# Altium schematic sheet MCU.SchDoc
size A3; SheetNumber: 7; SheetTotal: 13
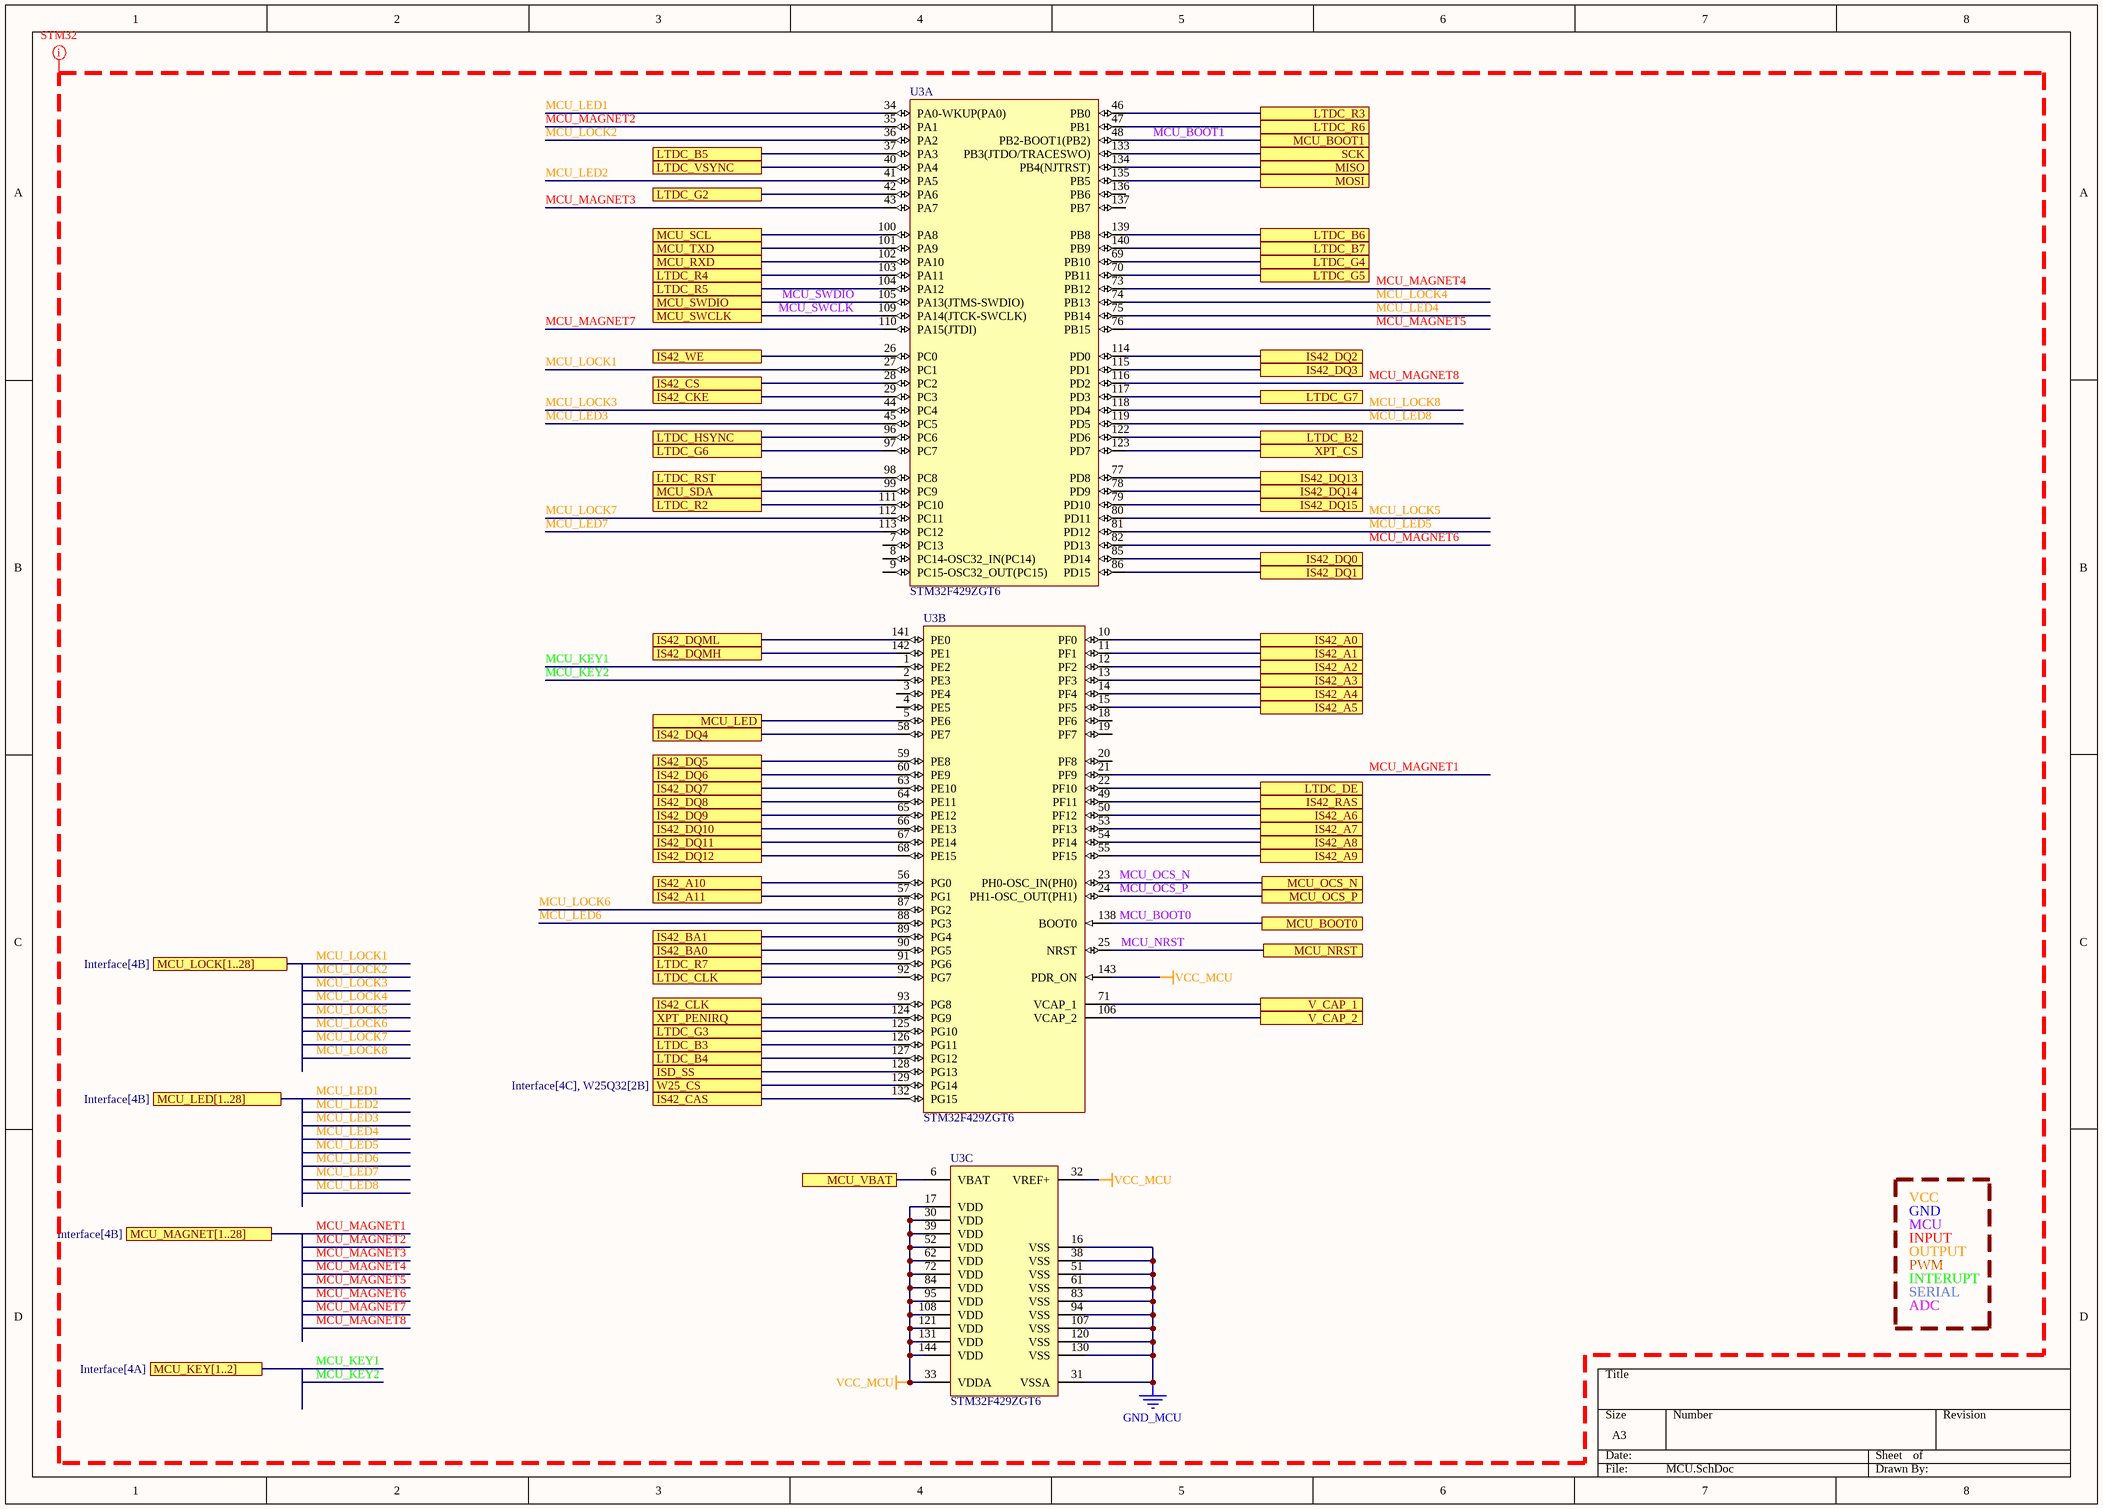
[diagram p0: MCU.SchDoc]

## Parts
U3  STM32F429ZGT6  [STM-LQFP144_N]  (parts A,B,C of 3)

## Ports
IS42_A0 (see Interface[4C], IS42S16400J[3B]), IS42_A1 (see Interface[4C], IS42S16400J[3B]), IS42_A2 (see Interface[4D], IS42S16400J[3B]), IS42_A3 (see Interface[4D], IS42S16400J[3B]), IS42_A4 (see Interface[4D], IS42S16400J[3B]), IS42_A5 (see Interface[4D], IS42S16400J[3B]), IS42_A6 (see Interface[4D], IS42S16400J[3B]), IS42_A7 (see Interface[4D], IS42S16400J[3B]), IS42_A8 (see Interface[4D], IS42S16400J[3B]), IS42_A9 (see Interface[4D], IS42S16400J[3C]), IS42_A10 (see Interface[4D], IS42S16400J[3C]), IS42_A11 (see Interface[4D], IS42S16400J[3C]), IS42_BA0 (see Interface[4C], IS42S16400J[1B]), IS42_BA1 (see Interface[4C], IS42S16400J[1B]), IS42_CAS (see Interface[4D], IS42S16400J[3C]), IS42_CKE (see Interface[4D], IS42S16400J[3C]), IS42_CLK (see Interface[4D], IS42S16400J[3C]), IS42_CS (see Interface[4D], IS42S16400J[3C]), IS42_DQ0 (see Interface[4C], IS42S16400J[1B]), IS42_DQ1 (see Interface[4C], IS42S16400J[1B]), IS42_DQ2 (see Interface[4C], IS42S16400J[1B]), IS42_DQ3 (see Interface[4C], IS42S16400J[1B]), IS42_DQ4 (see Interface[4C], IS42S16400J[1B]), IS42_DQ5 (see Interface[4C], IS42S16400J[1B]), IS42_DQ6 (see Interface[4C], IS42S16400J[1C]), IS42_DQ7 (see Interface[4C], IS42S16400J[1C]), IS42_DQ8 (see Interface[4C], IS42S16400J[1C]), IS42_DQ9 (see Interface[4C], IS42S16400J[1C]), IS42_DQ10 (see Interface[4C], IS42S16400J[1C]), IS42_DQ11 (see Interface[4C], IS42S16400J[1C]), IS42_DQ12 (see Interface[4C], IS42S16400J[1C]), IS42_DQ13 (see Interface[4C], IS42S16400J[1C]), IS42_DQ14 (see Interface[4C], IS42S16400J[1C]), IS42_DQ15 (see Interface[4C], IS42S16400J[1C]), IS42_DQMH (see Interface[4D], IS42S16400J[3C]), IS42_DQML (see Interface[4D], IS42S16400J[3C]), IS42_RAS (see Interface[4D], IS42S16400J[3C]), IS42_WE (see Interface[4D], IS42S16400J[3C]), ISD_SS (see Interface[4B], ISD1730[1B]), LTDC_B2 (see Interface[6C], LCD TFT 50 Pin[3B]), LTDC_B3 (see Interface[6C], LCD TFT 50 Pin[3B]), LTDC_B4 (see Interface[6C], LCD TFT 50 Pin[3B]), LTDC_B5 (see Interface[6C], LCD TFT 50 Pin[3A]), LTDC_B6 (see Interface[6B], LCD TFT 50 Pin[3A]), LTDC_B7 (see Interface[6B], LCD TFT 50 Pin[3A]), LTDC_CLK (see Interface[6C], LCD TFT 50 Pin[3C]), LTDC_DE (see Interface[6C], LCD TFT 50 Pin[3C]), LTDC_G2 (see Interface[6C], LCD TFT 50 Pin[3B]), LTDC_G3 (see Interface[6C], LCD TFT 50 Pin[3B]), LTDC_G4 (see Interface[6C], LCD TFT 50 Pin[3B]), LTDC_G5 (see Interface[6C], LCD TFT 50 Pin[3B]), LTDC_G6 (see Interface[6C], LCD TFT 50 Pin[3B]), LTDC_G7 (see Interface[6C], LCD TFT 50 Pin[3B]), LTDC_HSYNC (see Interface[6D], LCD TFT 50 Pin[3C]), LTDC_R2 (see Interface[6C], LCD TFT 50 Pin[3C]), LTDC_R3 (see Interface[6C], LCD TFT 50 Pin[3C]), LTDC_R4 (see Interface[6C], LCD TFT 50 Pin[3B]), LTDC_R5 (see Interface[6C], LCD TFT 50 Pin[3B]), LTDC_R6 (see Interface[6C], LCD TFT 50 Pin[3B]), LTDC_R7 (see Interface[6C], LCD TFT 50 Pin[3B]), LTDC_RST (see Interface[6D], LCD TFT 50 Pin[3C]), LTDC_VSYNC (see Interface[6C], LCD TFT 50 Pin[3C]), MCU_BOOT0 (see Interface[6A], STM32_AUX[2B]), MCU_BOOT1 (see Interface[6A], STM32_AUX[2A]), MCU_KEY[1..2] (see Interface[4A]), MCU_LED (see Interface[4A]), MCU_LED[1..28] (see Interface[4B]), MCU_LOCK[1..28] (see Interface[4B]), MCU_MAGNET[1..28] (see Interface[4B]), MCU_NRST (see Interface[6B], STM32_AUX[3A]), MCU_OCS_N (see Interface[6B], STM32_AUX[4A]), MCU_OCS_P (see Interface[6B], STM32_AUX[4A]), MCU_RXD (see Interface[6A]), MCU_SCL (see Interface[4A], EEPROM[3B]), MCU_SDA (see Interface[4A], EEPROM[3B]), MCU_SWCLK (see Interface[6A], STM32_AUX[2B]), MCU_SWDIO (see Interface[6A], STM32_AUX[2B]), MCU_TXD (see Interface[6A]), MCU_VBAT (see Interface[6B], STM32_AUX[1D]), MISO (see Interface[4B]), MOSI (see Interface[4B]), SCK (see Interface[4B]), V_CAP_1 (see Interface[6B], STM32_AUX[3C]), V_CAP_2 (see Interface[6B], STM32_AUX[3C]), W25_CS (see Interface[4C], W25Q32[2B]), XPT_CS (see Interface[4B], Touch XPT2046[3C]), XPT_PENIRQ (see Interface[4B], Touch XPT2046[3C])

## Nets
GND_MCU: U3.16(VSS) U3.31(VSSA) U3.38(VSS) U3.51(VSS) U3.61(VSS) U3.83(VSS) U3.94(VSS) U3.107(VSS) U3.120(VSS) U3.130(VSS)
VCC_MCU: U3.17(VDD) U3.30(VDD) U3.32(VREF+) U3.33(VDDA) U3.39(VDD) U3.52(VDD) U3.62(VDD) U3.72(VDD) U3.84(VDD) U3.95(VDD) U3.108(VDD) U3.121(VDD) U3.131(VDD) U3.143(PDR_ON) U3.144(VDD)
IS42_A0: U3.10(PF0) ; port IS42_A0
IS42_A1: U3.11(PF1) ; port IS42_A1
IS42_A2: U3.12(PF2) ; port IS42_A2
IS42_A3: U3.13(PF3) ; port IS42_A3
IS42_A4: U3.14(PF4) ; port IS42_A4
IS42_A5: U3.15(PF5) ; port IS42_A5
IS42_A6: U3.50(PF12) ; port IS42_A6
IS42_A7: U3.53(PF13) ; port IS42_A7
IS42_A8: U3.54(PF14) ; port IS42_A8
IS42_A9: U3.55(PF15) ; port IS42_A9
IS42_A10: U3.56(PG0) ; port IS42_A10
IS42_A11: U3.57(PG1) ; port IS42_A11
IS42_BA0: U3.90(PG5) ; port IS42_BA0
IS42_BA1: U3.89(PG4) ; port IS42_BA1
IS42_CAS: U3.132(PG15) ; port IS42_CAS
IS42_CKE: U3.29(PC3) ; port IS42_CKE
IS42_CLK: U3.93(PG8) ; port IS42_CLK
IS42_CS: U3.28(PC2) ; port IS42_CS
IS42_DQ0: U3.85(PD14) ; port IS42_DQ0
IS42_DQ1: U3.86(PD15) ; port IS42_DQ1
IS42_DQ2: U3.114(PD0) ; port IS42_DQ2
IS42_DQ3: U3.115(PD1) ; port IS42_DQ3
IS42_DQ4: U3.58(PE7) ; port IS42_DQ4
IS42_DQ5: U3.59(PE8) ; port IS42_DQ5
IS42_DQ6: U3.60(PE9) ; port IS42_DQ6
IS42_DQ7: U3.63(PE10) ; port IS42_DQ7
IS42_DQ8: U3.64(PE11) ; port IS42_DQ8
IS42_DQ9: U3.65(PE12) ; port IS42_DQ9
IS42_DQ10: U3.66(PE13) ; port IS42_DQ10
IS42_DQ11: U3.67(PE14) ; port IS42_DQ11
IS42_DQ12: U3.68(PE15) ; port IS42_DQ12
IS42_DQ13: U3.77(PD8) ; port IS42_DQ13
IS42_DQ14: U3.78(PD9) ; port IS42_DQ14
IS42_DQ15: U3.79(PD10) ; port IS42_DQ15
IS42_DQMH: U3.142(PE1) ; port IS42_DQMH
IS42_DQML: U3.141(PE0) ; port IS42_DQML
IS42_RAS: U3.49(PF11) ; port IS42_RAS
IS42_WE: U3.26(PC0) ; port IS42_WE
ISD_SS: U3.128(PG13) ; port ISD_SS
LTDC_B2: U3.122(PD6) ; port LTDC_B2
LTDC_B3: U3.126(PG11) ; port LTDC_B3
LTDC_B4: U3.127(PG12) ; port LTDC_B4
LTDC_B5: U3.37(PA3) ; port LTDC_B5
LTDC_B6: U3.139(PB8) ; port LTDC_B6
LTDC_B7: U3.140(PB9) ; port LTDC_B7
LTDC_CLK: U3.92(PG7) ; port LTDC_CLK
LTDC_DE: U3.22(PF10) ; port LTDC_DE
LTDC_G2: U3.42(PA6) ; port LTDC_G2
LTDC_G3: U3.125(PG10) ; port LTDC_G3
LTDC_G4: U3.69(PB10) ; port LTDC_G4
LTDC_G5: U3.70(PB11) ; port LTDC_G5
LTDC_G6: U3.97(PC7) ; port LTDC_G6
LTDC_G7: U3.117(PD3) ; port LTDC_G7
LTDC_HSYNC: U3.96(PC6) ; port LTDC_HSYNC
LTDC_R2: U3.111(PC10) ; port LTDC_R2
LTDC_R3: U3.46(PB0) ; port LTDC_R3
LTDC_R4: U3.103(PA11) ; port LTDC_R4
LTDC_R5: U3.104(PA12) ; port LTDC_R5
LTDC_R6: U3.47(PB1) ; port LTDC_R6
LTDC_R7: U3.91(PG6) ; port LTDC_R7
LTDC_RST: U3.98(PC8) ; port LTDC_RST
LTDC_VSYNC: U3.40(PA4) ; port LTDC_VSYNC
MCU_BOOT0: U3.138(BOOT0) ; port MCU_BOOT0
MCU_BOOT1: U3.48(PB2-BOOT1(PB2)) ; port MCU_BOOT1
MCU_KEY1: U3.1(PE2)
MCU_KEY2: U3.2(PE3)
MCU_LED: U3.5(PE6) ; port MCU_LED
MCU_LED1: U3.34(PA0-WKUP(PA0))
MCU_LED2: U3.41(PA5)
MCU_LED3: U3.45(PC5)
MCU_LED4: U3.75(PB14)
MCU_LED5: U3.81(PD12)
MCU_LED6: U3.88(PG3)
MCU_LED7: U3.113(PC12)
MCU_LED8: U3.119(PD5)
MCU_LOCK1: U3.27(PC1)
MCU_LOCK2: U3.36(PA2)
MCU_LOCK3: U3.44(PC4)
MCU_LOCK4: U3.74(PB13)
MCU_LOCK5: U3.80(PD11)
MCU_LOCK6: U3.87(PG2)
MCU_LOCK7: U3.112(PC11)
MCU_LOCK8: U3.118(PD4)
MCU_MAGNET1: U3.21(PF9)
MCU_MAGNET2: U3.35(PA1)
MCU_MAGNET3: U3.43(PA7)
MCU_MAGNET4: U3.73(PB12)
MCU_MAGNET5: U3.76(PB15)
MCU_MAGNET6: U3.82(PD13)
MCU_MAGNET7: U3.110(PA15(JTDI))
MCU_MAGNET8: U3.116(PD2)
MCU_NRST: U3.25(NRST) ; port MCU_NRST
MCU_OCS_N: U3.23(PH0-OSC_IN(PH0)) ; port MCU_OCS_N
MCU_OCS_P: U3.24(PH1-OSC_OUT(PH1)) ; port MCU_OCS_P
MCU_RXD: U3.102(PA10) ; port MCU_RXD
MCU_SCL: U3.100(PA8) ; port MCU_SCL
MCU_SDA: U3.99(PC9) ; port MCU_SDA
MCU_SWCLK: U3.109(PA14(JTCK-SWCLK)) ; port MCU_SWCLK
MCU_SWDIO: U3.105(PA13(JTMS-SWDIO)) ; port MCU_SWDIO
MCU_TXD: U3.101(PA9) ; port MCU_TXD
MCU_VBAT: U3.6(VBAT) ; port MCU_VBAT
MISO: U3.134(PB4(NJTRST)) ; port MISO
MOSI: U3.135(PB5) ; port MOSI
SCK: U3.133(PB3(JTDO/TRACESWO)) ; port SCK
V_CAP_1: U3.71(VCAP_1) ; port V_CAP_1
V_CAP_2: U3.106(VCAP_2) ; port V_CAP_2
W25_CS: U3.129(PG14) ; port W25_CS
XPT_CS: U3.123(PD7) ; port XPT_CS
XPT_PENIRQ: U3.124(PG9) ; port XPT_PENIRQ

Not connected (* = marked no-connect by the designer): U3 3(PE4) 4(PE5) 7(PC13) 8(PC14-OSC32_IN(PC14)) 9(PC15-OSC32_OUT(PC15)) 18(PF6) 19(PF7) 20(PF8) 136(PB6) 137(PB7)

## Layout directives
net class STM32: GND_MCU, MCU_BOOT0, MCU_BOOT1, MCU_KEY1, MCU_KEY2, MCU_LED1, MCU_LED2, MCU_LED3, MCU_LED4, MCU_LED5, MCU_LED6, MCU_LED7, MCU_LED8, MCU_LOCK1, MCU_LOCK2, MCU_LOCK3, MCU_LOCK4, MCU_LOCK5, MCU_LOCK6, MCU_LOCK7, MCU_LOCK8, MCU_MAGNET1, MCU_MAGNET2, MCU_MAGNET3, MCU_MAGNET4, MCU_MAGNET5, MCU_MAGNET6, MCU_MAGNET7, MCU_MAGNET8, MCU_NRST, MCU_OCS_N, MCU_OCS_P, MCU_SWCLK, MCU_SWDIO, VCC_MCU

## Notes on the sheet
- INPUT
- OUTPUT
- MCU
- GND
- VCC
- INTERUPT
- SERIAL
- ADC
- PWM

## Library data of the parts
U3 = STM32F429ZGT6: ARM Cortex-M4 32-bit MCU+FPU, 225 DMIPS, 1024 kB Flash, 256 kB Internal RAM, 114 I/Os, 144-pin LQFP, -40 to 85 degC, Tray; Manufacturer: STMicroelectronics; D/A Converter: 2x12-bit; FLASH Size (Prog) (kB): 1024; I/Os (High Current): 114; Internal RAM Size (kB): 256; Operating Frequency(F) (Processor speed) (MHz): 180; Supply Voltage(Vcc) max (V): 3.6; Supply Voltage(Vcc) min (V): 1.8; DatasheetVersion: Rev. 2; PackageVersion: Rev. 4, 06/2013; PackageReference: LQFP144; PackageDescription: 144-Pin Low Profile Quad Flat Package, 20 x 20 mm Body, 0.5 mm Pitch; Supplier 1: Digi-Key; Supplier Part Number 1: STM32F429ZGT6-ND; Supplier 2: Newark; Supplier Part Number 2: 06X3675; Supplier 3: Mouser; Supplier Part Number 3: 511-STM32F429ZGT6; Core: ARM Cortex-M4; Packing: Tray; Mounting Technology: Surface Mount; PartNumber: STM32F429ZGT6; ComponentLink1Description: Manufacturer URL; ComponentLink1URL: http://www.st.com/web/en/home.html; ComponentLink2Description: Datasheet; ComponentLink2URL: http://www.st.com/st-web-ui/static/active/en/resource/technical/document/data_brief/DM00053488.pdf; ComponentLink3Description: Package Specification; ComponentLink3URL: http://www.st.com/st-web-ui/static/active/en/resource/technical/document/datasheet/DM00037051.pdf